# Altium schematic sheet Strathim block-scheme.SchDoc
size A
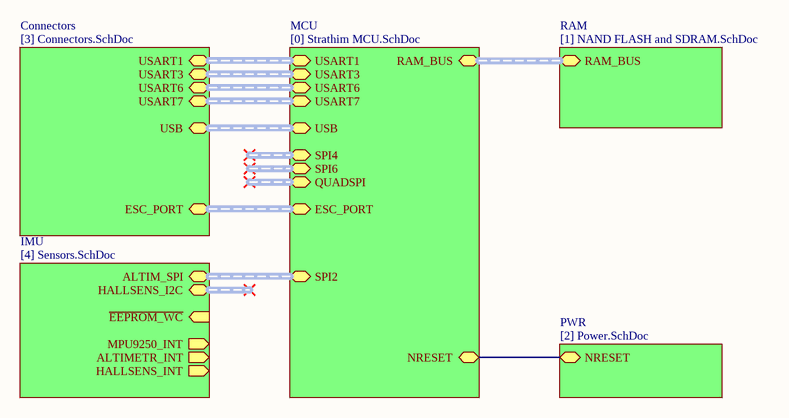
[diagram p0: Strathim block-scheme.SchDoc]

## Sub-sheets
Connectors = [3] Connectors.SchDoc: USART1 (harness UART), USART6 (harness UART), USART3 (harness UART), USART7 (harness UART), ESC_PORT (harness ESC_CHANNELS), USB (harness USB)
IMU = [4] Sensors.SchDoc: MPU9250_INT (out), ALTIM_SPI (harness SPI), ~{EEPROM_WC} (in), HALLSENS_I2C (harness I2C), ALTIMETR_INT (out), HALLSENS_INT (out)
MCU = [0] Strathim MCU.SchDoc: RAM_BUS (harness RAM), USART6 (harness UART), USART3 (harness UART), ESC_PORT (harness ESC_CHANNELS), USART1 (harness UART), USART7 (harness UART), SPI4 (harness SPI), SPI2 (harness SPI), SPI6 (harness SPI), QUADSPI (harness QUADSPI), NRESET, USB (harness USB)
PWR = [2] Power.SchDoc: NRESET
RAM = [1] NAND FLASH and SDRAM.SchDoc: RAM_BUS (harness RAM)

## Nets
(unnamed): sheet MCU/NRESET, sheet PWR/NRESET

## Buses and harness runs
harness sheet Connectors/ESC_PORT = sheet MCU/ESC_PORT
harness sheet Connectors/USART1 = sheet MCU/USART1
harness sheet Connectors/USART3 = sheet MCU/USART3
harness sheet Connectors/USART6 = sheet MCU/USART6
harness sheet Connectors/USART7 = sheet MCU/USART7
harness sheet Connectors/USB = sheet MCU/USB
harness sheet IMU/ALTIM_SPI = sheet MCU/SPI2
harness sheet MCU/RAM_BUS = sheet RAM/RAM_BUS